# Altium project 2_way_splitter.PrjPcb
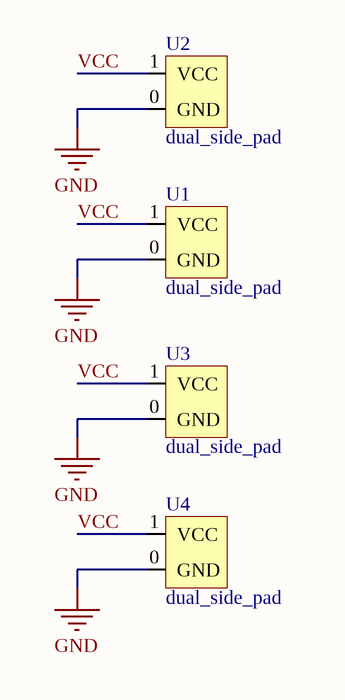
[diagram p0: 2_way_splitter.SchDoc]
1 sheet, 4 parts. Net scope: global (net labels, ports and power ports of the same name join across sheets).
Board file: 2_way_splitter.PcbDoc

## Sheet 2_way_splitter.SchDoc
size A

### Parts
U1  dual_side_pad  [dual_side_pad]
U2  dual_side_pad  [dual_side_pad]
U3  dual_side_pad  [dual_side_pad]
U4  dual_side_pad  [dual_side_pad]

### Nets
GND: U1.0(GND) U2.0(GND) U3.0(GND) U4.0(GND)
VCC: U1.1(VCC) U2.1(VCC) U3.1(VCC) U4.1(VCC)